# Altium schematic sheet LED_Driver.SchDoc
size A; SheetNumber: 6; SheetTotal: 10
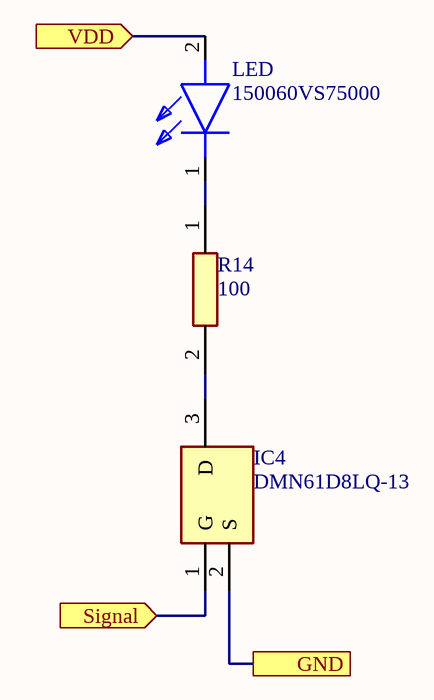
[diagram p0: LED_Driver.SchDoc]

## Parts
IC4  DMN61D8LQ-13  [SOT96P240X110-3N]
LED  150060VS75000  [LEDC1608X70N]
R14  100  [RESC1608X55N]

## Ports
GND, Signal (in), VDD (in)

## Nets
GND: IC4.2(S) ; port GND
Signal: IC4.1(G) ; port Signal
VDD: LED.2(A) ; port VDD
NetIC4_3: IC4.3(D) R14.2
NetLED_1: LED.1(K) R14.1

## Library data of the parts
IC4 = DMN61D8LQ-13: Integrated Circuit; Manufacturer_Name: Diodes Incorporated; Datasheet Link: https://www.diodes.com//assets/Datasheets/DMN61D8LQ.pdf; Height: 1.1mm; Manufacturer_Part_Number: DMN61D8LQ-13; Mouser Part Number: 621-DMN61D8LQ-13; Mouser Price/Stock: https://www.mouser.co.uk/ProductDetail/Diodes-Incorporated/DMN61D8LQ-13?qs=DBvH5xl4UymJgoulTjiNCg%3D%3D; Arrow Part Number: DMN61D8LQ-13; Arrow Price/Stock: https://www.arrow.com/en/products/dmn61d8lq-13/diodes-incorporated?utm_currency=USD&region=nac
LED = 150060VS75000: LED; Manufacturer_Name: Wurth Elektronik; Datasheet Link: https://www.we-online.com/catalog/datasheet/150060VS75000.pdf; Height: 0.7mm; Manufacturer_Part_Number: 150060VS75000; Mouser Part Number: 710-150060VS75000; Mouser Price/Stock: https://www.mouser.co.uk/ProductDetail/Wurth-Elektronik/150060VS75000?qs=LlUlMxKIyB1Q1Bi5mQ%2FKLw%3D%3D
R14 = RC0603JR-7W100RL: Resistor; Manufacturer_Name: Yageo Group; Datasheet Link: http://www.yageo.com/documents/recent/PYu-RC0603_51_RoHS_L_v5.pdf; Height: 0.55mm; Manufacturer_Part_Number: RC0603JR-7W100RL; Mouser Part Number: 603-RC0603JR-7W100RL; Mouser Price/Stock: https://www.mouser.co.uk/ProductDetail/YAGEO/RC0603JR-7W100RL?qs=tggtontpCXNb6PZs9ghEpg%3D%3D; Arrow Part Number: RC0603JR-7W100RL; Arrow Price/Stock: https://www.arrow.com/en/products/rc0603jr-7w100rl/yageo?region=nac